# Altium schematic sheet OldETHERNET.SchDoc: Ethernet
size A3; Date: 31 08 2013; Author: Rachid AKKOUCHE; CompanyName: MDI; DrawnBy: Rachid AKKOUCHE; Engineer: Rachid AKKOUCHE; Organization: RASoftware; Address1: 52 J03, rue de la crèche; Address2: 77100 MEAUX; Address3: FRANCE; DocumentNumber: BRA2013083011C; Revision: C; SheetNumber: 11; SheetTotal: 11; Telephone: +33651604047; Email: rachid.akkouche@wanadoo.fr; IsUserConfigurable: Y; Proprietaire: MDI System; Dessinepar: -; Verifiepar: -; Time: 16:56
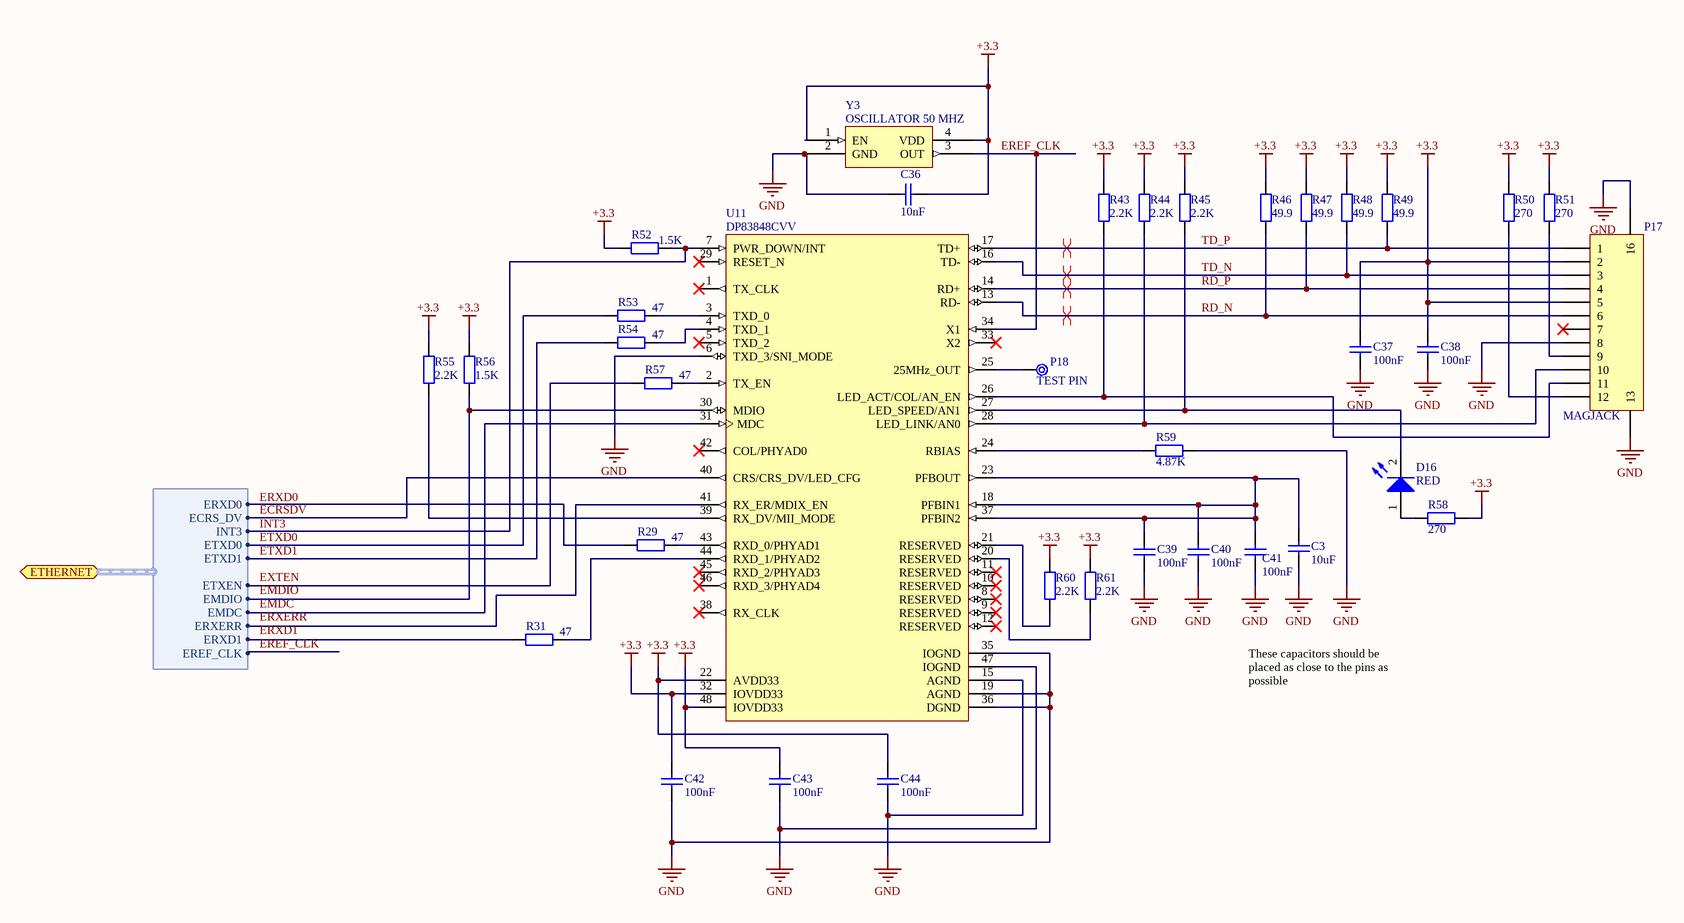
[diagram p0: OldETHERNET.SchDoc]

## Parts
C3  10uF  [C0805]
C36  10nF  [C0805]
C37  100nF  [C0805]
C38  100nF  [C0805]
C39  100nF  [C0805]
C40  100nF  [C0805]
C41  100nF  [C0805]
C42  100nF  [C0805]
C43  100nF  [C0805]
C44  100nF  [C0805]
D16  Couleur: RED  [0603-LEDR]  (hidden comment: HSMH-C190)
P17  MAGJACK  [RJ45_8+LED]
P18  TEST PIN  [TP]
R29  47  [R0805]
R31  47  [R0805]
R43  2.2K  [R0805]
R44  2.2K  [R0805]
R45  2.2K  [R0805]
R46  49.9  [R0805]
R47  49.9  [R0805]
R48  49.9  [R0805]
R49  49.9  [R0805]
R50  270  [R0805]
R51  270  [R0805]
R52  1.5K  [R0805]
R53  47  [R0805]
R54  47  [R0805]
R55  2.2K  [R0805]
R56  1.5K  [R0805]
R57  47  [R0805]
R58  270  [R0805]
R59  4.87K  [R0805]
R60  2.2K  [R0805]
R61  2.2K  [R0805]
U11  DP83848CVV  [LLP40P600X600X80_HS-41N]
Y3  OSCILLATOR 50 MHZ  [X3225]

## Ports
ETHERNET (harness ETHERNET)

## Harnesses
ETHERNET: ETXEN, ETXD0, ETXD1, INT3, EMDIO, EMDC, ECRS_DV, ERXERR, ERXD0, ERXD1, EREF_CLK

## Nets
+3.3: C36.1 C37.1 C38.1 C42.1 C43.1 C44.1 P17.2 P17.5 R43.2 R44.2 R45.2 R46.2 R47.2 R48.2 R49.2 R50.2 R51.2 R52.2 R55.2 R56.2 R58.1 R60.2 R61.2 U11.22(AVDD33) U11.32(IOVDD33) U11.48(IOVDD33) Y3.1(EN) Y3.4(VDD)
GND: C3.2 C36.2 C37.2 C38.2 C39.2 C40.2 C41.2 C42.2 C43.2 C44.2 P17.8 P17.13 P17.16 R59.1 U11.6(TXD_3/SNI_MODE) U11.15(AGND) U11.19(AGND) U11.35(IOGND) U11.36(DGND) U11.47(IOGND) Y3.2(GND)
ECRSDV: U11.40(CRS/CRS_DV/LED_CFG) ; port ETHERNET.ECRS_DV
EREF_CLK: U11.34(X1) Y3.3(OUT) ; port ETHERNET.EREF_CLK
ETXD0: R53.2 ; port ETHERNET.ETXD0
ETXD1: R54.2 ; port ETHERNET.ETXD1
RD_N: P17.6 R46.1 U11.13(RD-)
RD_P: P17.4 R47.1 U11.14(RD+)
TD_N: P17.3 R48.1 U11.16(TD-)
TD_P: P17.1 R49.1 U11.17(TD+)
NetC3_1: C3.1 C39.1 C40.1 C41.1 U11.18(PFBIN1) U11.23(PFBOUT) U11.37(PFBIN2)
NetD16_1: D16.1(A) R58.2
NetD16_2: D16.2(K) R45.1 U11.27(LED_SPEED/AN1)
NetP17_9: P17.9 R51.1
NetP17_10: P17.10 R44.1 U11.28(LED_LINK/AN0)
NetP17_11: P17.11 R43.1 U11.26(LED_ACT/COL/AN_EN)
NetP17_12: P17.12 R50.1
NetP18_1: P18.1 U11.25(25MHz_OUT)
NetR29_1: R29.1 U11.43(RXD_0/PHYAD1)
NetR29_2: R29.2 ; port ETHERNET.ERXD0
NetR31_1: R31.1 U11.44(RXD_1/PHYAD2)
NetR31_2: R31.2 ; port ETHERNET.ERXD1
NetR52_1: R52.1 U11.7(PWR_DOWN/INT) ; port ETHERNET.INT3
NetR53_1: R53.1 U11.3(TXD_0)
NetR54_1: R54.1 U11.4(TXD_1)
NetR55_1: R55.1 U11.39(RX_DV/MII_MODE)
NetR56_1: R56.1 U11.30(MDIO) ; port ETHERNET.EMDIO
NetR57_1: R57.1 U11.2(TX_EN)
NetR57_2: R57.2 ; port ETHERNET.ETXEN
NetR59_2: R59.2 U11.24(RBIAS)
NetR60_1: R60.1 U11.21(RESERVED)
NetR61_1: R61.1 U11.20(RESERVED)
NetU11_31: U11.31(MDC) ; port ETHERNET.EMDC
NetU11_41: U11.41(RX_ER/MDIX_EN) ; port ETHERNET.ERXERR

Not connected (* = marked no-connect by the designer): P17 7*; U11 1(TX_CLK)* 5(TXD_2)* 8(RESERVED)* 9(RESERVED)* 10(RESERVED)* 11(RESERVED)* 12(RESERVED)* 29(RESET_N)* 33(X2)* 38(RX_CLK)* 42(COL/PHYAD0)* 45(RXD_2/PHYAD3)* 46(RXD_3/PHYAD4)*

## Layout directives
differential pair: RD_N, RD_P, TD_N, TD_P

## Notes on the sheet
- These capacitors should be placed as close to the pins as possible
- Labels drawn without touching a wire or pin: EMDC, EMDIO, ERXD0, ERXD1, ERXERR, EXTEN, INT3
- Ce document est la propriété de
- Project:
- Il ne peut être divulgué sans l'accord écrit de l'un de ses représentants dûment mandaté
- Title:
- Number:
- Date:
- Time:
- Size:
- A3
- Revision:
- Sheet
- of
- 52 J03 rue de la crèche
- Draw by:
- 77100 Meaux

## Library data of the parts
C3 = Cap 0805 1uF: Capacitor; Manufacturer: YAGEO; Manufacturer Part Number: CC0805KKX5R5BB106; Unit: pcs; SuppliedAmount: 3000; MinAmount: 100; Capacitor type: ceramic; Capacitor kind: MLCC; Capacitance: 10µF; Operating voltage: 6.3V; Dielectric: X5R; Tolerance: ±10%; Supplier 1: TME; Supplier Part Number 1: CC0805KKX5R5106; Category: 0805 MLCC SMD Capacitors; Stock 1: 19000; Weight: 0,034; Multiples: 100; Mounting: SMD; Case: 0805; ComponentLink1URL: http://www.tme.eu/en/details/cc0805kkx5r5106/0805-mlcc-smd-capacitors/yageo/cc0805kkx5r5bb106/; ComponentLink1Description: http://www.tme.eu/en/details/cc0805kkx5r5106/0805-mlcc-smd-capacitors/yageo/cc0805kkx5r5bb106/
C36 = Cap 0805 10nF: Capacitor; Manufacturer: MULTICOMP; Manufacturer Part Number: MC0805B103M500CT; Supplier 1: Farnell; RoHS: YES; Pricing 1: 1=0,009, 10=0,008, 100=0,008, 500=0,006, 1000=0,006 (EUR); ComponentLink1URL: http://www.newark.com/pdfs/datasheets/spc/Ta-1100.pdf; ComponentLink1Description: http://www.newark.com/pdfs/datasheets/spc/Ta-1100.pdf; Supplier Part Number 1: 1708707
C37-C44 = Cap 0805 100nF: Capacitor; Manufacturer: MULTICOMP; Manufacturer Part Number: MCCA000296; Supplier 1: Farnell; Supplier Part Number 1: 1759167; Pricing 1: 100=0,01, 500=0,008, 1000=0,006, 4000=0,005 (EUR); ComponentLink1URL: http://www.farnell.com/datasheets/1520827.pdf; ComponentLink1Description: http://www.farnell.com/datasheets/1520827.pdf
D16 = HSMH-C190: Surface Mount Chip LED, Red; Manufacturer: AVAGO TECHNOLOGIES; Manufacturer Part Number: HSMH-C190.; Taille de lampe: 0.8mm x 1; Couleur de LED: Rouge; Intensité lumineuse: 17; Angle, vision: 170°; Courant, direct, If: 20; Tension, direct à  If: 1.8; Montage LED: CMS; Forme de lentille: Rectangulaire; Longueur d'onde typ.: 626; SVHC: No SVHC (19-Dec-2012); Dissipation de puissance: 65; Intensité lumineuse min. à  If: 2.8; Intensité lumineuse typique: 10; Largeur (externe): 0.8; Longueur d'onde dominante: 639; Longueur d'onde, crête: 630; Longueur/hauteur: 1.6; Matière: AlGaAs; Nombre de broches: 2; Orientation de montage opto: Dessus; Orientation sortie de lumière: Top Emitting; Température de fonctionnement: -30°C à +85; Température de fonctionnement max..: 85; Température, stockage min.: -40; Température d'utilisation min: -30; Tension, Vf max..: 2.6; Tension, Vf min.: 2.1; Type de LED: Standard; Supplier 1: Farnell; Supplier Part Number 1: 8554641; RoHS: YES; Stock 1: 13902; Pricing 1: 5=0,06, 25=0,059, 100=0,057, 250=0,052, 500=0,047 (EUR); MSL: MSL 2A - 4 semaines; Couleur, LED: Rouge; Profondeur: 0.8; Température, stockage max..: 85; Tension, Vf typ.: 1.8; ComponentLink1URL: http://www.farnell.com/datasheets/313031.pdf; ComponentLink1Description: http://www.farnell.com/datasheets/313031.pdf; ComponentLink2URL: http://www.farnell.com/datasheets/55927.pdf; ComponentLink2Description: http://www.farnell.com/datasheets/55927.pdf
P17 = Header 12: Header, 12-Pin; Manufacturer: STEWART CONNECTOR; Manufacturer Part Number: SI-60062-F; LatestRevisionDate: 17-Jul-2002; LatestRevisionNote: Re-released for DXP Platform.; Publisher: Altium Limited; Supplier 1: Farnell; RoHS: YES; Stock 1: 1607; Pricing 1: 1=5,39, 10=5,07, 50=4,75, 100=4,65 (EUR); ComponentLink1URL: http://www.farnell.com/datasheets/1523782.pdf; ComponentLink1Description: http://www.farnell.com/datasheets/1523782.pdf; ComponentLink2URL: http://www.farnell.com/cad/1683659.pdf; ComponentLink2Description: http://www.farnell.com/cad/1683659.pdf; ComponentLink3URL: http://www.farnell.com/datasheets/79319.pdf; ComponentLink3Description: http://www.farnell.com/datasheets/79319.pdf; Supplier Part Number 1: 1137983
R29 R31 R53 R54 R57 = Resistor 0805 47: Resistor; Manufacturer: MULTICOMP; Manufacturer Part Number: MC0063W0603147R; Supplier 1: Farnell; RoHS: YES; Pricing 1: 5000=0,001 (EUR); ComponentLink1URL: http://www.farnell.com/datasheets/1729046.pdf; ComponentLink1Description: http://www.farnell.com/datasheets/1729046.pdf; Supplier Part Number 1: 2130751
R43-R45 R55 R60 R61 = Resistor 0805 2.2K: Resistor; Manufacturer: MULTICOMP; Manufacturer Part Number: MC01W080512K2; Supplier 1: Farnell; RoHS: YES; Pricing 1: 5000=0,001 (EUR); ComponentLink1URL: http://www.farnell.com/datasheets/1729047.pdf; ComponentLink1Description: http://www.farnell.com/datasheets/1729047.pdf; Supplier Part Number 1: 2129138
R46-R49 = Resistor 0805 49.9: Resistor; Manufacturer: MULTICOMP; Manufacturer Part Number: MC01W0805149R9; Product Range: MULTICOMP - MC Series; Puissance: 100; Tolérance de résistance: ± 1%; Type de boîtier de résistance: 0805; Type de résistance: Couche épaisse; Coefficient de température: ± 200; Tension: 150; Type de packaging: Full Reel; SVHC: No SVHC (20-Jun-2013); Resistor Mounting: CMS; Supplier 1: Farnell; RoHS: YES; Pricing 1: 5000=0,001 (EUR); Résistance: 49.9; MSL: (Non Applicable); ComponentLink1URL: http://www.farnell.com/datasheets/1729047.pdf; ComponentLink1Description: http://www.farnell.com/datasheets/1729047.pdf; Supplier Part Number 1: 2129011
R50 R51 = Resistor 0805 270: Resistor; Manufacturer: MULTICOMP; Manufacturer Part Number: MC01W08051270R; Product Range: MULTICOMP - MC Series; Puissance: 100; Tolérance de résistance: ± 1%; Type de boîtier de résistance: 0805; Type de résistance: Couche épaisse; Coefficient de température: ± 100; Tension: 150; Type de packaging: Full Reel; SVHC: No SVHC (20-Jun-2013); Resistor Mounting: CMS; Supplier 1: Farnell; Supplier Part Number 1: 2129067; RoHS: YES; Pricing 1: 5000=0,001 (EUR); Résistance: 270; MSL: -; ComponentLink1URL: http://www.farnell.com/datasheets/1729047.pdf; ComponentLink1Description: http://www.farnell.com/datasheets/1729047.pdf
R52 R56 = Resistor 0805 1.5K: Resistor; Manufacturer: MULTICOMP; Manufacturer Part Number: MC00625W040211K5; Supplier 1: Farnell; RoHS: YES; Pricing 1: 10000=0,001 (EUR); ComponentLink1URL: http://www.farnell.com/datasheets/1729045.pdf; ComponentLink1Description: http://www.farnell.com/datasheets/1729045.pdf; Supplier Part Number 1: 2130366
R58 = Resistor 0805 1K: Resistor; Manufacturer: MULTICOMP; Manufacturer Part Number: MC01W08051270R; Product Range: MULTICOMP - MC Series; Puissance: 100; Tolérance de résistance: ± 1%; Type de boîtier de résistance: 0805; Type de résistance: Couche épaisse; Coefficient de température: ± 100; Tension: 150; Type de packaging: Full Reel; SVHC: No SVHC (20-Jun-2013); Resistor Mounting: CMS; Supplier 1: Farnell; Supplier Part Number 1: 2129067; RoHS: YES; Pricing 1: 5000=0,001 (EUR); Résistance: 270; MSL: -; ComponentLink1URL: http://www.farnell.com/datasheets/1729047.pdf; ComponentLink1Description: http://www.farnell.com/datasheets/1729047.pdf
R59 = Resistor 0805: Resistor; Manufacturer: MULTICOMP; Manufacturer Part Number: MC01W080514K87; Supplier 1: Farnell; Supplier Part Number 1: 2129169; RoHS: YES; Pricing 1: 5000=0,001 (EUR); ComponentLink1URL: http://www.farnell.com/datasheets/1729047.pdf; ComponentLink1Description: http://www.farnell.com/datasheets/1729047.pdf
U11 = DP83848CVV: PHYTER® Commercial Temperature Single Port 10/100 Mb/s Ethernet Physical Layer Transceiver, 48-pin LQFP; Manufacturer: TEXAS INSTRUMENTS; Manufacturer Part Number: DP83848MSQ/NOPB; Supplier 1: Farnell; Supplier Part Number 1: 1602446; RoHS: YES; Stock 1: 30; Pricing 1: 1=2,78, 10=1,86, 100=1,4, 200=1,26, 400=1,03, 2000=0,989, 2000=0,969, 7000=0,951 (EUR); ComponentLink1URL: http://www.farnell.com/datasheets/1772482.pdf; ComponentLink1Description: http://www.farnell.com/datasheets/1772482.pdf; ComponentLink2URL: http://www.farnell.com/cad/1547462.zip; ComponentLink2Description: http://www.farnell.com/cad/1547462.zip
Y3 = OSCILLLATOR: 50 MHZ 3.3Vdc CMOS SMD CRYSTAL CLOCK OSCILLATOR; Manufacturer: ABRACON; Manufacturer Part Number: ASE-50.000MHZ-LR-T; Fréquence: 50; Stabilité en fréquence: ± 25; Tension, alimentation min.: 3.135; Tension, alimentation max..: 3.465; Capacité, charge: 15; Oscillator Mounting: CMS; Nombre de broches: 4; Température d'utilisation min: -40; Température de fonctionnement max..: 85; SVHC: No SVHC (19-Dec-2012); Température de fonctionnement: -40°C à +85; Tension d'alimentation: 3.3; Supplier 1: Farnell; RoHS: YES; Pricing 1: 1=2,76, 10=2,38, 50=1,8, 100=1,6, 200=1,26, 500=1,22 (EUR); ComponentLink1URL: http://www.abracon.com/Oscillators/ASEseries.pdf; ComponentLink1Description: http://www.abracon.com/Oscillators/ASEseries.pdf; Supplier Part Number 1: 2101315